# Altium schematic sheet PRUC-Voltmeter_USB-Protection.SchDoc: USB Protection
size A4; SheetNumber: 6; SheetTotal: 9
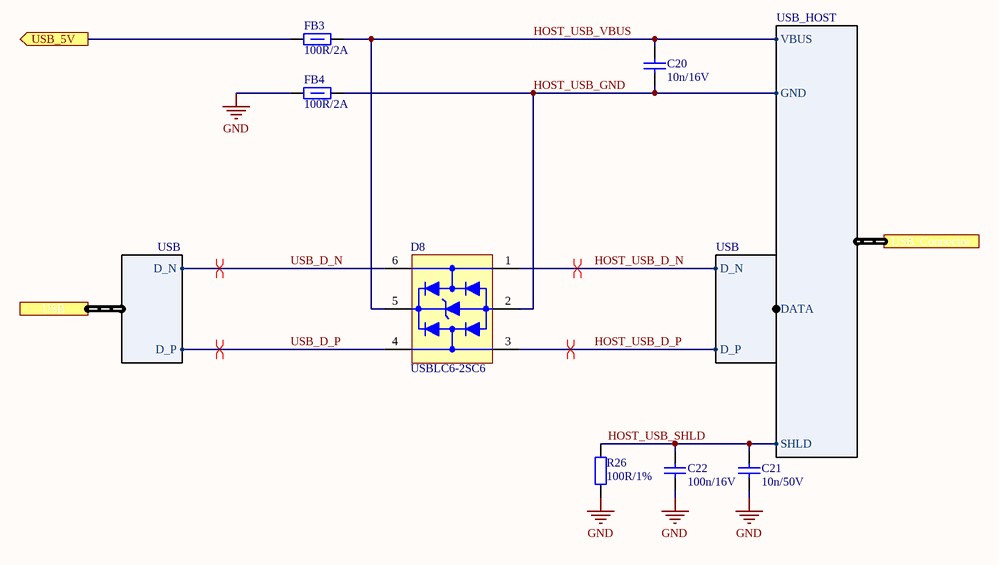
[diagram p0: PRUC-Voltmeter_USB-Protection.SchDoc]

## Parts
C20  10n/16V  [MLCC_0603]
C21  10n/50V  [MLCC_0805]
C22  100n/16V  [MLCC_0603]
D8  USBLC6-2SC6  [SOT23-6]
FB3  100R/2A  [FerriteBead_0603]
FB4  100R/2A  [FerriteBead_0603]
R26  100R/1%  [R_0603]

## Ports
USB (harness USB), USB_5V (out), USB_Connector (harness USB_HOST)

## Harnesses
USB_HOST: DATA, VBUS, GND, SHLD
USB: D_P, D_N

## Nets
GND: C21.2 C22.2 FB4.1 R26.2
HOST_USB_D_N: D8.1(I/O_1) ; harness USB.D_N
HOST_USB_D_P: D8.3(I/O_2) ; harness USB.D_P
HOST_USB_GND: C20.2 D8.2(GND) FB4.2 ; port USB_Connector.GND
HOST_USB_SHLD: C21.1 C22.1 R26.1 ; port USB_Connector.SHLD
HOST_USB_VBUS: C20.1 D8.5(VBUS) FB3.2 ; port USB_Connector.VBUS
USB_5V: FB3.1 ; port USB_5V
USB_D_N: D8.6(I/O_4) ; port USB.D_N
USB_D_P: D8.4(I/O_3) ; port USB.D_P

## Layout directives
differential pair: HOST_USB_D_N, HOST_USB_D_P, USB_D_N, USB_D_P

## Notes on the sheet
- Project:
- Title:
- Variant Name:
- Author:
- Checked by:
- Ver/Rev:
- Date:
- Approved by:
- Sheet:
- of
- File name:

## Library data of the parts
C20 = CL10B103KB8NNNC: Manufacturer: Samsung; Part Description: 0603 General Multilayer Ceramic Capacitor; Index: 29; Part Number: CL10B103KB8NNNC; Value: 10n/16V; SMD: true; Manufacturer Part Number: CL10B103KB8NNNC; Supplier 1: TME; Supplier Part Number 1: CL10B103KB8NNNC; HelpURL: https://www.tme.eu/pl/Document/7da762c1dbaf553c64ad9c40d3603826/mlcc_samsung.pdf; Category: Capacitors
C21 = CL21B103KBANNNC: Manufacturer: Samsung; Part Description: 0805 General Multilayer Ceramic Capacitor; Index: 9; Part Number: CL21B103KBANNNC; Value: 10n/50V; SMD: true; Manufacturer Part Number: CL21B103KBANNNC; Supplier 1: TME; Supplier Part Number 1: CL21B103KBANNNC; HelpURL: https://www.tme.eu/pl/Document/efa69d9c2b7084c0ec85cad1371d68e3/PESD3V3S2UT.pdf; Category: Capacitors
C22 = CL10B104KO8NNNC: Manufacturer: Samsung; Part Description: 0603 General Multilayer Ceramic Capacitor; Index: 14; Part Number: CL10B104KO8NNNC; Value: 100n/16V; SMD: true; Manufacturer Part Number: CL10B104KO8NNNC; Supplier 1: TME; Supplier Part Number 1: CL10B104KO8NNNC; HelpURL: https://www.tme.eu/pl/Document/7da762c1dbaf553c64ad9c40d3603826/mlcc_samsung.pdf; Category: Capacitors
D8 = USBLC6-2SC6: Manufacturer: STMicroelectronics; Part Description: Very low capacitance ESD protection; Index: 109; Part Number: USBLC6-2SC6; SMD: true; Manufacturer Part Number: USBLC6-2SC6; Supplier 1: TME; Supplier Part Number 1: USBLC6-2SC6; HelpURL: https://www.tme.eu/Document/db59d28d28a96c34f26d05f234ff409c/USBLC6-2.pdf; Category: Diodes
FB3 FB4 = BLM18EG101TN1D: Manufacturer: Murata; Part Description: Chip EMIFIL Inductor Type Chip Ferrite Beads; Index: 30; Part Number: BLM18EG101TN1D; Value: 100R/2A; SMD: true; Manufacturer Part Number: BLM18EG101TN1D; Supplier 1: TME; Supplier Part Number 1: BLM18EG101TN1D; HelpURL: https://www.tme.eu/Document/f75b66d976bcb5ae8e5c98dcdbe6ac82/BLM18EG101TN1%23.pdf; Category: Inductors
R26 = 0603SAF1000T5E: Manufacturer: Royalohm; Part Description: 0603 Thick Film Chip Resistor; Index: 70; Part Number: 0603SAF1000T5E; Value: 100R/1%; SMD: true; Manufacturer Part Number: 0603SAF1000T5E; Supplier 1: TME; Supplier Part Number 1: SMD0603-100R-1%; HelpURL: https://www.tme.eu/pl/Document/b315665a56acbc42df513c99b390ad98/ROYALOHM-THICKFILM.pdf; Category: Resistors